# Altium project PCB_ControlBoard.PrjPcb
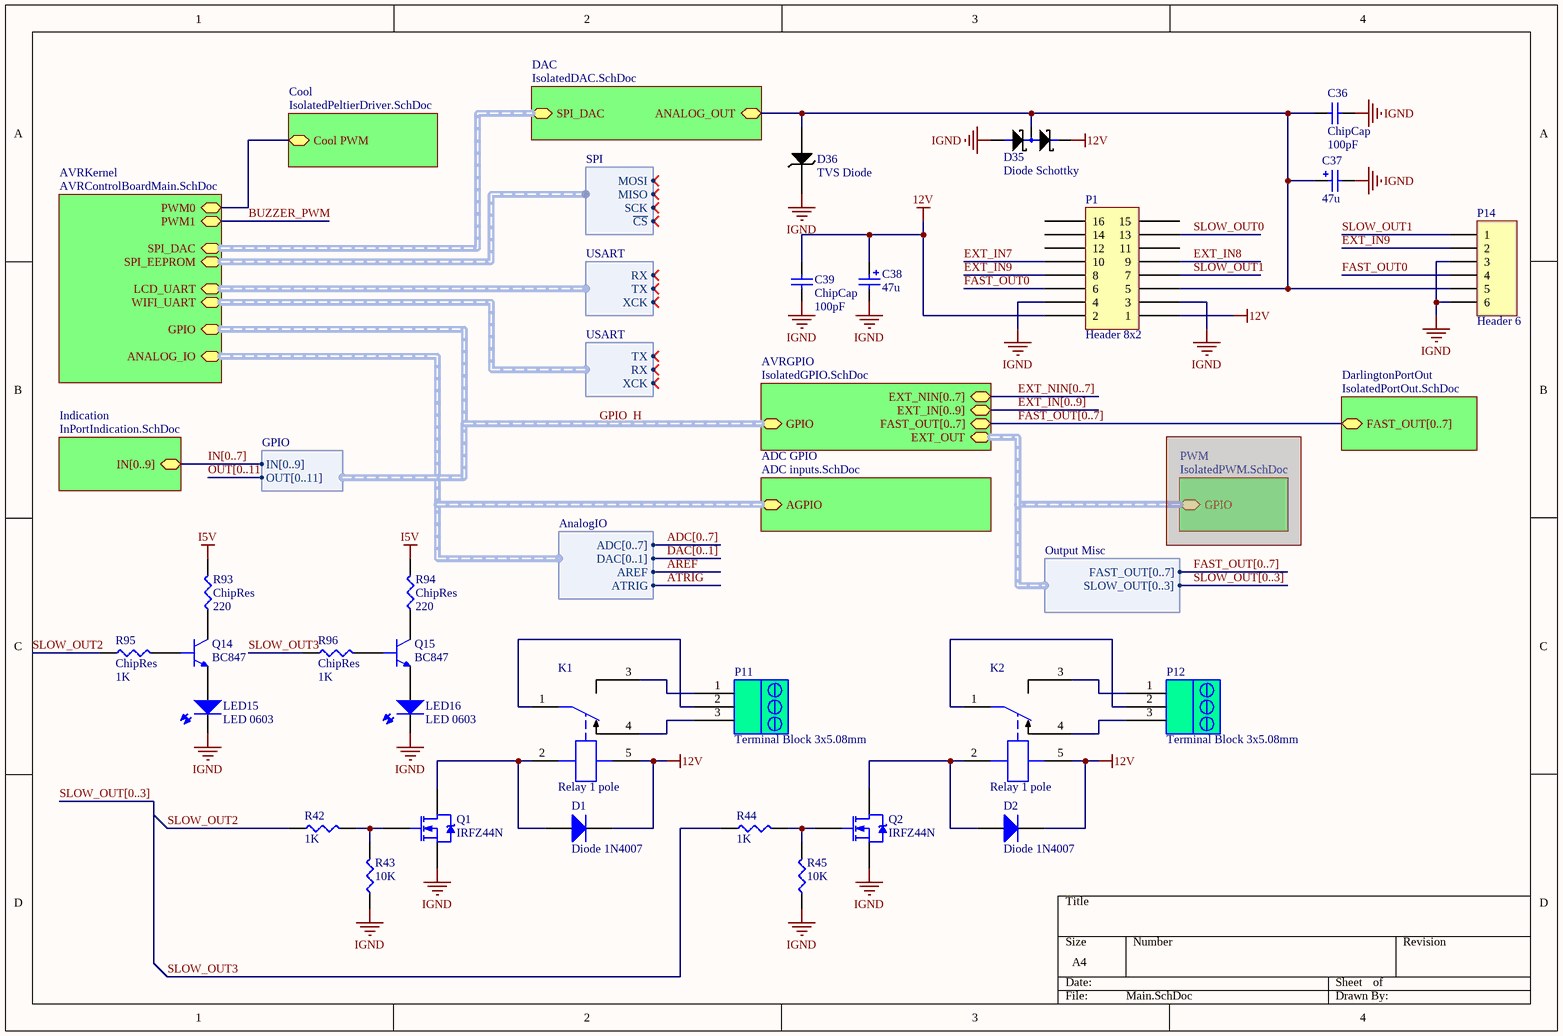
[diagram p0: Main.SchDoc]
9 sheets, 269 parts. Net scope: hierarchical (ports join the sheet entries above them; power ports are global).
Board file: PCBAVRControlBoard.PcbDoc
Sheets:
  Main.SchDoc
    AVRKernel = AVRControlBoardMain.SchDoc
    AVRGPIO = IsolatedGPIO.SchDoc
    DAC = IsolatedDAC.SchDoc
    ADC GPIO = ADC inputs.SchDoc
    DarlingtonPortOut = IsolatedPortOut.SchDoc
    Indication = InPortIndication.SchDoc
    Cool = IsolatedPeltierDriver.SchDoc

## Sheet Main.SchDoc
size A4

### Parts
C36  ChipCap  value 100pF  [CAP0805]
C37  value 47u  [CAPC7343]  (hidden comment: Cap Pol SMD)
C38  value 47u  [CAPC7343]  (hidden comment: Cap Pol SMD)
C39  ChipCap  value 100pF  [CAP0805]
D1  Diode 1N4007  [DO-41]
D2  Diode 1N4007  [DO-41]
D35  Diode Schottky  [SOT23]
D36  TVS Diode  [DO-214AS]
K1  Relay 1 pole  [G5LA]
K2  Relay 1 pole  [G5LA]
LED15  LED 0603  [LED 0603]
LED16  LED 0603  [LED 0603]
P1  Header 8x2  [Header 8x2 HL]
P11  Terminal Block 3x5.08mm  [Socket 3x5.08]
P12  Terminal Block 3x5.08mm  [Socket 3x5.08]
P14  Header 6  [HDR1X6]
Q1  IRFZ44N  [TO-220AB]
Q2  IRFZ44N  [TO-220AB]
Q14  BC847  [SOT23]
Q15  BC847  [SOT23]
R42  value 1K  [RES0805]  (hidden comment: ChipRes)
R43  value 10K  [RES0805]  (hidden comment: ChipRes)
R44  value 1K  [RES0805]  (hidden comment: ChipRes)
R45  value 10K  [RES0805]  (hidden comment: ChipRes)
R93  ChipRes  value 220  [RES0805]
R94  ChipRes  value 220  [RES0805]
R95  ChipRes  value 1K  [RES0805]
R96  ChipRes  value 1K  [RES0805]

### Sub-sheets
ADC GPIO = ADC inputs.SchDoc: AGPIO (harness AnalogIO)
AVRGPIO = IsolatedGPIO.SchDoc: GPIO (harness GPIO), EXT_IN[0..9], EXT_OUT (harness Output Misc), FAST_OUT[0..7], EXT_NIN[0..7]
AVRKernel = AVRControlBoardMain.SchDoc: SPI_DAC (harness SPI), SPI_EEPROM (harness SPI), LCD_UART (harness USART), WIFI_UART (harness USART), ANALOG_IO (harness AnalogIO), GPIO (harness GPIO), PWM0, PWM1
Cool = IsolatedPeltierDriver.SchDoc: Cool PWM
DAC = IsolatedDAC.SchDoc: SPI_DAC (harness SPI), ANALOG_OUT
DarlingtonPortOut = IsolatedPortOut.SchDoc: FAST_OUT[0..7]
Indication = InPortIndication.SchDoc: IN[0..9]
PWM = IsolatedPWM.SchDoc (masked out): GPIO (harness Output Misc)

### Harnesses
USART: TX, RX, XCK
AnalogIO: ADC[0..7], DAC[0..1], AREF, ATRIG
SPI: MOSI, MISO, SCK, ~{CS}
Output Misc: FAST_OUT[0..7], SLOW_OUT[0..3]
GPIO: IN[0..9], OUT[0..11]

### Nets
12V: C38.1 C39.1 D1.2(K) D2.2(K) D35.2 K1.5 K2.5 P1.1 P1.2
I5V: R93.2 R94.2
IGND: C36.2 C37.2 C38.2 C39.2 D35.1 D36.1 LED15.1 LED16.1 P1.3 P1.4 P14.3 P14.6 Q1.3(S) Q2.3(S) R43.1 R45.1
EXT_IN7: P1.10
EXT_IN8: P1.9
EXT_IN9: P1.8 P14.2
FAST_OUT0: P1.6 P14.4
PWM0: sheet AVRKernel/PWM0, sheet Cool/Cool PWM
SLOW_OUT0: P1.13  [project net EXT_OUT0]
SLOW_OUT1: P1.7 P14.1  [project net EXT_OUT1]
SLOW_OUT2: R42.1 R95.1  [project net EXT_OUT2]
SLOW_OUT3: R44.1 R96.1  [project net EXT_OUT3]
NetC36_1: C36.1 C37.1 D35.3 D36.2 P1.5 P14.5 ; sheet DAC/ANALOG_OUT
NetD1_1: D1.1(A) K1.2 Q1.2(D)
NetD2_1: D2.1(A) K2.2 Q2.2(D)
NetK1_1: K1.1 P11.2
NetK1_3: K1.3 P11.1
NetK1_4: K1.4 P11.3
NetK2_1: K2.1 P12.2
NetK2_3: K2.3 P12.1
NetK2_4: K2.4 P12.3
NetLED15_2: LED15.2 Q14.2
NetLED16_2: LED16.2 Q15.2
NetQ1_1: Q1.1(G) R42.2 R43.2
NetQ2_1: Q2.1(G) R44.2 R45.2
NetQ14_1: Q14.1 R95.2
NetQ14_3: Q14.3 R93.1
NetQ15_1: Q15.1 R96.2
NetQ15_3: Q15.3 R94.1

Not connected (* = marked no-connect by the designer): P1 11 12 14 15 16

### Buses and harness runs
bus ADC[0..7]
bus DAC[0..1]
bus EXT_IN[0..9] = sheet AVRGPIO/EXT_IN[0..9]
bus EXT_NIN[0..7] = sheet AVRGPIO/EXT_NIN[0..7]
bus FAST_OUT[0..7]
bus FAST_OUT[0..7] = sheet AVRGPIO/FAST_OUT[0..7] = sheet DarlingtonPortOut/FAST_OUT[0..7]
bus IN[0..7] = sheet Indication/IN[0..9]
bus OUT[0..11]
bus SLOW_OUT[0..3]
harness GPIO_H = sheet AVRGPIO/GPIO = sheet AVRKernel/GPIO
harness sheet ADC GPIO/AGPIO = sheet AVRKernel/ANALOG_IO
harness sheet AVRKernel/SPI_DAC = sheet DAC/SPI_DAC

### Library data of the parts
C36 C39 = ChipCap: Capacitor; Published: 8-Jun-2000; LatestRevisionDate: 17-Jul-2002; LatestRevisionNote: Re-released for DXP Platform.; PackageReference: RAD-0.3; Publisher: Altium Limited
C37 C38 = Cap Pol Chip: Polarized Capacitor (Radial); Supplier 1: Digi-Key; Supplier Part Number 1: 399-4029-1-ND
D1 D2 = Diode 1N4007: 1 Amp General Purpose Rectifier; Published: 8-Jun-2000; LatestRevisionDate: 17-Jul-2002; LatestRevisionNote: Re-released for DXP Platform.; DatasheetVersion: 1998; PackageVersion: Aug-1999; PackageReference: DO-41; Publisher: Altium Limited; PackageDescription: Diode, Axial; Body 5.2 x 2.7 mm (LxDia. max), Lead Dia. 0.86 mm (max); Code_JEDEC: DO-204-AL; ComponentLink1Description: Manufacturer Link; ComponentLink1URL: http://www.fairchildsemi.com/; ComponentLink2Description: Datasheet; ComponentLink2URL: http://www.fairchildsemi.com/ds/1N%2F1N4001.pdf
D35 = Schottky Diode: 2-Diode Schottky
D36 = TVS Diode SMA
K1 K2 = Relay G5LE: Relay G5LE 10A Single Pole
LED15 LED16 = LED0603
P1 = Header 16pins (8x2): Header 16pins (8x2) Hold Latch
P11 P12 = Socket_3x5.08_RA_2Wall: Terminal Block Socket Right Angle 3x5.08mm 2-Wall
P14 = Header 6: Header, 6-Pin; LatestRevisionDate: 17-Jul-2002; LatestRevisionNote: Re-released for DXP Platform.; Publisher: Altium Limited
Q1 Q2 = IRFZ44N: HEXFET Power MOSFET; Note: Pin 2 is electrically connected to pin 4.; Published: 8-Jun-2000; LatestRevisionDate: 17-Jul-2002; LatestRevisionNote: Re-released for DXP Platform.; DatasheetVersion: Aug-1997; PackageVersion: Feb-1997; PackageReference: TO-220AB; Publisher: Altium Limited; PackageDescription: TO, Thru-Hole, Vertical, Heatsink Mounted; 3 In-Line Leads; Pitch 2.54 mm; ComponentLink1Description: Manufacturer Link; ComponentLink1URL: http://www.irf.com/; ComponentLink2Description: Datasheet; ComponentLink2URL: http://www.irf.com/product-info/datasheets/data/irfz44n.pdf
Q14 Q15 = BC847: NPN transistor
R42-R45 R93-R96 = ChipRes: Chip resistor

## Sheet AVRControlBoardMain.SchDoc
size A4
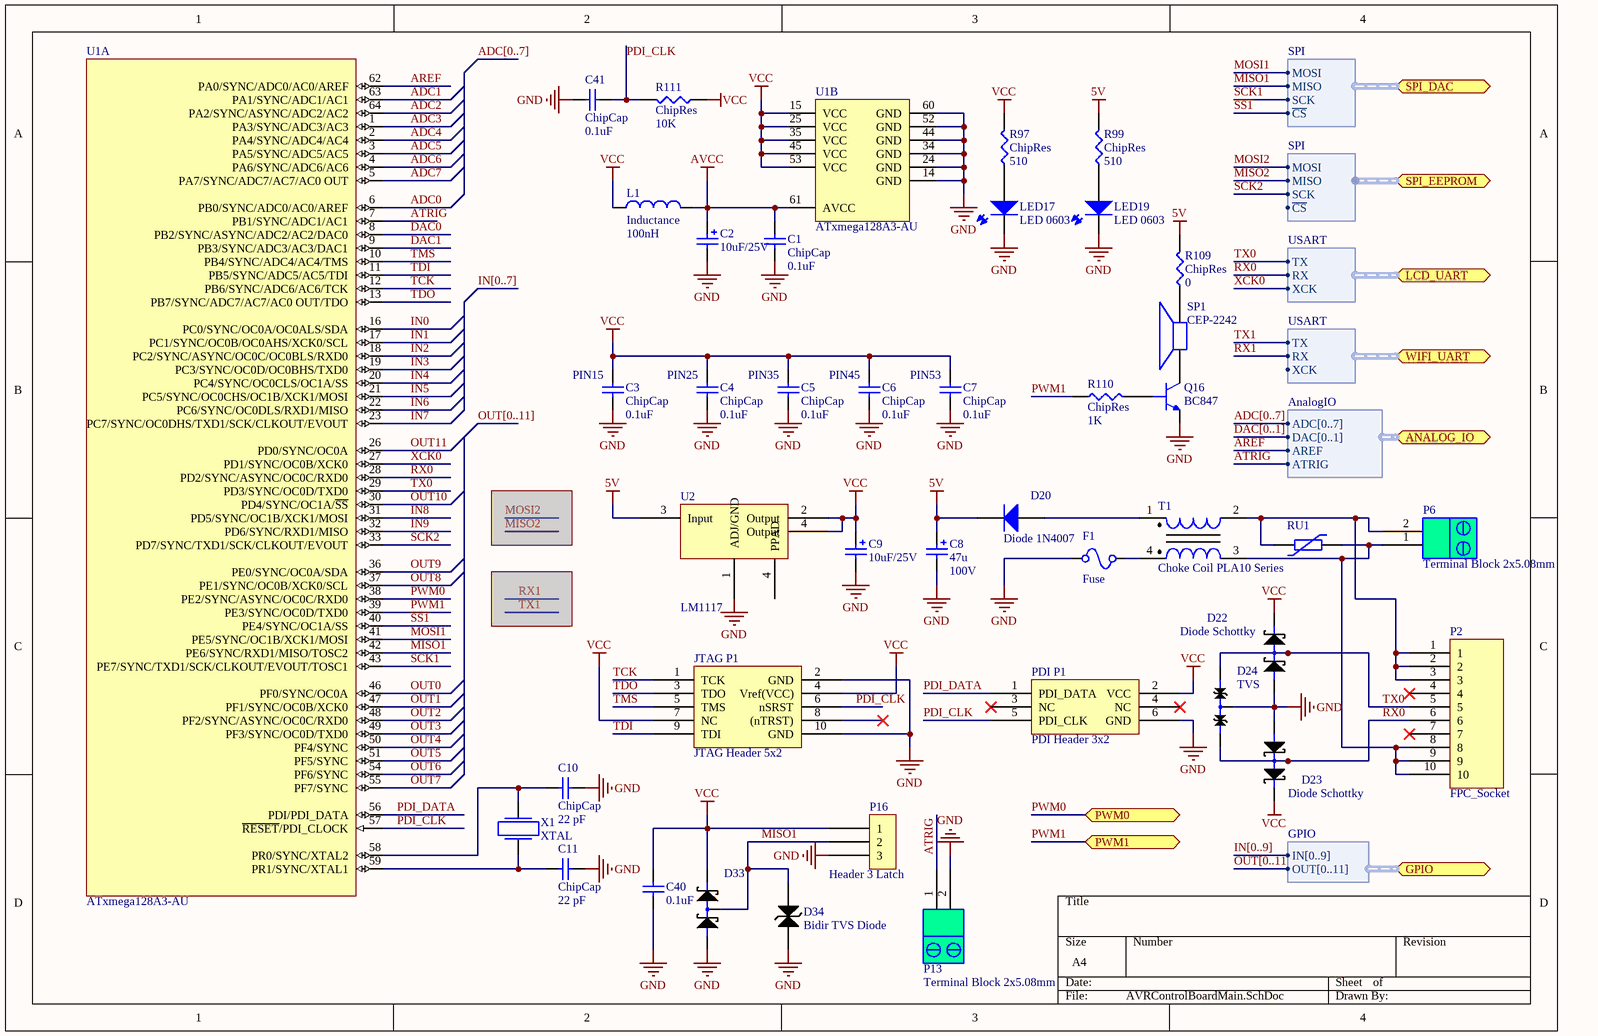
[diagram p1: AVRControlBoardMain.SchDoc]

### Parts
C1  ChipCap  value 0.1uF  [CAP0805]
C2  value 10uF/25V  [CAPC7343]  (hidden comment: Cap Pol SMD)
C3  ChipCap  value 0.1uF  [CAP0805]
C4  ChipCap  value 0.1uF  [CAP0805]
C5  ChipCap  value 0.1uF  [CAP0805]
C6  ChipCap  value 0.1uF  [CAP0805]
C7  ChipCap  value 0.1uF  [CAP0805]
C8  value 47u  Voltage: 100V  [CAPPR5-10x17_1]  (hidden comment: Cap Pol 100/47)
C9  value 10uF/25V  [CAPC7343]  (hidden comment: Cap Pol SMD)
C10  ChipCap  value 22 pF  [CAP0805]
C11  ChipCap  value 22 pF  [CAP0805]
C40  value 0.1uF  [CAP0805]  (hidden comment: ChipCap)
C41  ChipCap  value 0.1uF  [CAP0805]
D20  Diode 1N4007  [DO-41]
D22  Diode Schottky  [SOT23]
D23  Diode Schottky  [SOT23]
D24  TVS  [SOT23]
D33  Diode Schottky  [SOT23]  (value not drawn)
D34  Bidir TVS Diode  [DO-214AS]
F1  Fuse  [PTC1812]
JTAG_P1  JTAG Header 5x2  [Header 5x2]
L1  Inductance  value 100nH  [CM45]
LED17  LED 0603  [PLCC-2]
LED19  LED 0603  [PLCC-2]
P2  FPC_Socket  [Molex FPC/FFC 10pin]
P6  Terminal Block 2x5.08mm  [Socket 2x5.08]
P13  Terminal Block 2x5.08mm  [Socket 2x5.08]
P16  Header 3 Latch  [Header 3 latch]
PDI_P1  PDI Header 3x2  [Header 3x2]
Q16  BC847  [SOT23]
R97  ChipRes  value 510  [RES0805]
R99  ChipRes  value 510  [RES0805]
R109  ChipRes  value 0  [RES0805]
R110  ChipRes  value 1K  [RES0805]
R111  ChipRes  value 10K  [RES0805]
RU1  Varistor S14F25  [S14K25]  (value not drawn)
SP1  CEP-2242  [Buzzer]
T1  Choke Coil PLA10 Series  [PLA10]
U1  ATxmega128A3-AU  [64A_L]  (parts A,B of 2)
U2  LM1117  [SOT223-4M]
X1  XTAL  [BCY-W2/E4.7]

### Ports
ANALOG_IO (harness AnalogIO), GPIO (harness GPIO), LCD_UART (harness USART), PWM0, PWM1, SPI_DAC (harness SPI), SPI_EEPROM (harness SPI), WIFI_UART (harness USART)

### Harnesses
SPI: MOSI, MISO, SCK, ~{CS}
USART: TX, RX, XCK
AnalogIO: ADC[0..7], DAC[0..1], AREF, ATRIG
GPIO: IN[0..9], OUT[0..11]

### Nets
5V: C8.1 D20.2(K) R99.2 R109.2 U2.3(Input)
AVCC: C1.2 C2.1 L1.1 U1.61(AVCC)
GND: C1.1 C2.2 C3.1 C4.1 C5.1 C6.1 C7.1 C8.2 C9.2 C10.1 C11.1 C40.2 C41.1 D22.1 D23.1 D24.3 D33.1 D34.2 F1.1 JTAG_P1.2(GND) JTAG_P1.10(GND) LED17.1 LED19.1 P13.2 P16.3 PDI_P1.6(GND) Q16.2 U1.14(GND) U1.24(GND) U1.34(GND) U1.44(GND) U1.52(GND) U1.60(GND) U2.1(ADJ/GND)
VCC: C3.2 C4.2 C5.2 C6.2 C7.2 C9.1 C40.1 D22.2 D23.2 D33.2 JTAG_P1.4(Vref(VCC)) JTAG_P1.7(NC) L1.2 P16.1 PDI_P1.2(VCC) R97.2 R111.1 U1.15(VCC) U1.25(VCC) U1.35(VCC) U1.45(VCC) U1.53(VCC) U2.2(Output) U2.4(PPAD)
ADC0: U1.6(PB0/SYNC/ADC0/AC0/AREF)
ADC1: U1.63(PA1/SYNC/ADC1/AC1)
ADC2: U1.64(PA2/SYNC/ASYNC/ADC2/AC2)
ADC3: U1.1(PA3/SYNC/ADC3/AC3)
ADC4: U1.2(PA4/SYNC/ADC4/AC4)
ADC5: U1.3(PA5/SYNC/ADC5/AC5)
ADC6: U1.4(PA6/SYNC/ADC6/AC6)
ADC7: U1.5(PA7/SYNC/ADC7/AC7/AC0_OUT)
AREF: U1.62(PA0/SYNC/ADC0/AC0/AREF) ; port ANALOG_IO.AREF
ATRIG: P13.1 U1.7(PB1/SYNC/ADC1/AC1) ; port ANALOG_IO.ATRIG
DAC0: U1.8(PB2/SYNC/ASYNC/ADC2/AC2/DAC0)
DAC1: U1.9(PB3/SYNC/ADC3/AC3/DAC1)
IN0: U1.16(PC0/SYNC/OC0A/OC0ALS/SDA)
IN1: U1.17(PC1/SYNC/OC0B/OC0AHS/XCK0/SCL)
IN2: U1.18(PC2/SYNC/ASYNC/OC0C/OC0BLS/RXD0)
IN3: U1.19(PC3/SYNC/OC0D/OC0BHS/TXD0)
IN4: U1.20(PC4/SYNC/OC0CLS/OC1A/SS)
IN5: U1.21(PC5/SYNC/OC0CHS/OC1B/XCK1/MOSI)
IN6: U1.22(PC6/SYNC/OC0DLS/RXD1/MISO)
IN7: U1.23(PC7/SYNC/OC0DHS/TXD1/SCK/CLKOUT/EVOUT)
IN8: U1.31(PD5/SYNC/OC1B/XCK1/MOSI)
IN9: U1.32(PD6/SYNC/RXD1/MISO)
MISO1: D33.3 D34.1 P16.2 U1.42(PE6/SYNC/RXD1/MISO/TOSC2) ; port SPI_DAC.MISO
MISO2: port SPI_EEPROM.MISO
MOSI1: U1.41(PE5/SYNC/OC1B/XCK1/MOSI) ; port SPI_DAC.MOSI  [project net DAC_MOSI]
MOSI2: port SPI_EEPROM.MOSI
OUT0: U1.46(PF0/SYNC/OC0A)
OUT1: U1.47(PF1/SYNC/OC0B/XCK0)
OUT2: U1.48(PF2/SYNC/ASYNC/OC0C/RXD0)
OUT3: U1.49(PF3/SYNC/OC0D/TXD0)
OUT4: U1.50(PF4/SYNC)
OUT5: U1.51(PF5/SYNC)
OUT6: U1.54(PF6/SYNC)
OUT7: U1.55(PF7/SYNC)
OUT8: U1.37(PE1/SYNC/OC0B/XCK0/SCL)
OUT9: U1.36(PE0/SYNC/OC0A/SDA)
OUT10: U1.30(PD4/SYNC/OC1A/~{SS})
OUT11: U1.26(PD0/SYNC/OC0A)
PDI_CLK: C41.2 JTAG_P1.6(nSRST) PDI_P1.5(PDI_CLK) R111.2 U1.57(~{RESET}/PDI_CLOCK)
PDI_DATA: PDI_P1.1(PDI_DATA) U1.56(PDI/PDI_DATA)
PWM0: U1.38(PE2/SYNC/ASYNC/OC0C/RXD0) ; port PWM0
PWM1: R110.1 U1.39(PE3/SYNC/OC0D/TXD0) ; port PWM1  [project net BUZZER_PWM]
RX0: D23.3 D24.2 P2.6 U1.28(PD2/SYNC/ASYNC/OC0C/RXD0) ; port LCD_UART.RX
RX1: port WIFI_UART.RX
~{SS1}: U1.40(PE4/SYNC/OC1A/SS) ; port SPI_DAC.~{CS}  [project net DAC_CS]
SCK1: U1.43(PE7/SYNC/TXD1/SCK/CLKOUT/EVOUT/TOSC1) ; port SPI_DAC.SCK  [project net DAC_SCK]
SCK2: U1.33(PD7/SYNC/TXD1/SCK/CLKOUT/EVOUT) ; port SPI_EEPROM.SCK
TCK: JTAG_P1.1(TCK) U1.12(PB6/SYNC/ADC6/AC6/TCK)
TDI: JTAG_P1.9(TDI) U1.11(PB5/SYNC/ADC5/AC5/TDI)
TDO: JTAG_P1.3(TDO) U1.13(PB7/SYNC/ADC7/AC7/AC0_OUT/TDO)
TMS: JTAG_P1.5(TMS) U1.10(PB4/SYNC/ADC4/AC4/TMS)
TX0: D22.3 D24.1 P2.5 U1.29(PD3/SYNC/OC0D/TXD0) ; port LCD_UART.TX
TX1: port WIFI_UART.TX
XCK0: U1.27(PD1/SYNC/OC0B/XCK0) ; port LCD_UART.XCK
NetC10_2: C10.2 U1.58(PR0/SYNC/XTAL2) X1.2
NetC11_2: C11.2 U1.59(PR1/SYNC/XTAL1) X1.1
NetD20_1: D20.1(A) T1.1
NetF1_2: F1.2 T1.4
NetLED17_2: LED17.2 R97.1
NetLED19_2: LED19.2 R99.1
NetP2_1: P2.1 P2.2 P2.3 P6.2 RU1.1 T1.2
NetP2_8: P2.8 P2.9 P2.10 P6.1 RU1.2 T1.3
NetQ16_1: Q16.1 R110.2
NetQ16_3: Q16.3 SP1.1
NetR109_1: R109.1 SP1.2

Not connected (* = marked no-connect by the designer): JTAG_P1 8((nTRST))*; P2 4* 7*; PDI_P1 3(NC)* 4(NC)*

### Buses and harness runs
bus ADC[0..7]
bus DAC[0..1]
bus IN[0..7]
bus IN[0..9]
bus OUT[0..11]

### Notes on the sheet
- (near C3) PIN15
- (near C4) PIN25
- (near C5) PIN35
- (near C6) PIN45
- (near C7) PIN53

### Library data of the parts
C1 C3-C7 C10 C11 C40 C41 = ChipCap: Capacitor; Published: 8-Jun-2000; LatestRevisionDate: 17-Jul-2002; LatestRevisionNote: Re-released for DXP Platform.; PackageReference: RAD-0.3; Publisher: Altium Limited
C2 C9 = Cap Pol Chip: Polarized Capacitor (Radial); Supplier 1: Digi-Key; Supplier Part Number 1: 399-4029-1-ND
C8 = Cap Pol 100/47: Polarized Capacitor (Radial); Supplier 1: Digi-Key; Supplier Part Number 1: P1284-ND
D20 = Diode 1N4007: 1 Amp General Purpose Rectifier; Published: 8-Jun-2000; LatestRevisionDate: 17-Jul-2002; LatestRevisionNote: Re-released for DXP Platform.; DatasheetVersion: 1998; PackageVersion: Aug-1999; PackageReference: DO-41; Publisher: Altium Limited; PackageDescription: Diode, Axial; Body 5.2 x 2.7 mm (LxDia. max), Lead Dia. 0.86 mm (max); Code_JEDEC: DO-204-AL; ComponentLink1Description: Manufacturer Link; ComponentLink1URL: http://www.fairchildsemi.com/; ComponentLink2Description: Datasheet; ComponentLink2URL: http://www.fairchildsemi.com/ds/1N%2F1N4001.pdf
D22 D23 D33 = Schottky Diode: 2-Diode Schottky
D24 = TVS Diode: Dual bidirectional voltage supresor
D34 = TVS Bidir Diode SMA
F1 = Fuse PTC1812: Fuse PTC 1812 Thermoresistor
JTAG_P1 = JTAG Header 5x2: JTAG Interface connctor
L1 = ChipInductance
LED17 LED19 = LED0603
P6 P13 = Socket_2x5.08_RA_2Wall: Terminal Block Socket Right Angle 2x5.08mm 2 Wall
P16 = Header 3 latch: Header 3 with latch
PDI_P1 = PDI Header 3x2: PDI Interface connector
Q16 = BC847: NPN transistor
R97 R99 R109-R111 = ChipRes: Chip resistor
RU1 = Varistor S14K25: varistor
SP1 = Buzzer CEP-2242: Buzzer
T1 = Choke Coil: Common Mode Rejection Choke Coil LA10 Series
U1 = ATxmega128A3-AU: 8/16-bit AVR XMEGA A3 Microcontroller, 1.6-3.6V, 128KB + 8KB Flash, 2KB EEPROM, 8KB SRAM, 64-pin TQFP, Industrial Grade (-40°C to 85°C), Pb-Free; Published: 1-Apr-2010; DatasheetVersion: revQ, Feb-2010; PackageVersion: revB, Oct-2001; PackageReference: 64A; Publisher: Altium Limited; PackageDescription: 64-Pin Plastic Thin Profile Quad Flat Pack, 14 x 14 x 1.0 mm Body, 0.8 mm Pitch (TQFP); Supplier 1: Digi-Key; Supplier Part Number 1: ATXMEGA128A3-AU-ND; Supplier 2: Farnell; Supplier Part Number 2: 1748550; Supplier 3: Mouser; Supplier Part Number 3: 556-ATXMEGA128A3-AU; Code_JEDEC: MS-026-AEB; ComponentLink1Description: Manufacturer Link; ComponentLink1URL: http://www.atmel.com/products/avr/default.asp?; ComponentLink2Description: ATxmega64A3/128A3/192A3/256A3 Datasheet; ComponentLink2URL: http://www.atmel.com/dyn/resources/prod_documents/doc8068.pdf; ComponentLink3Description: Atmel.com Home; ComponentLink3URL: http://www.atmel.com
U2 = LM1117: Power Mgt Voltage Regulator
X1 = Crystall oscillator: Quartz crystall oscillator

## Sheet IsolatedGPIO.SchDoc
size A4
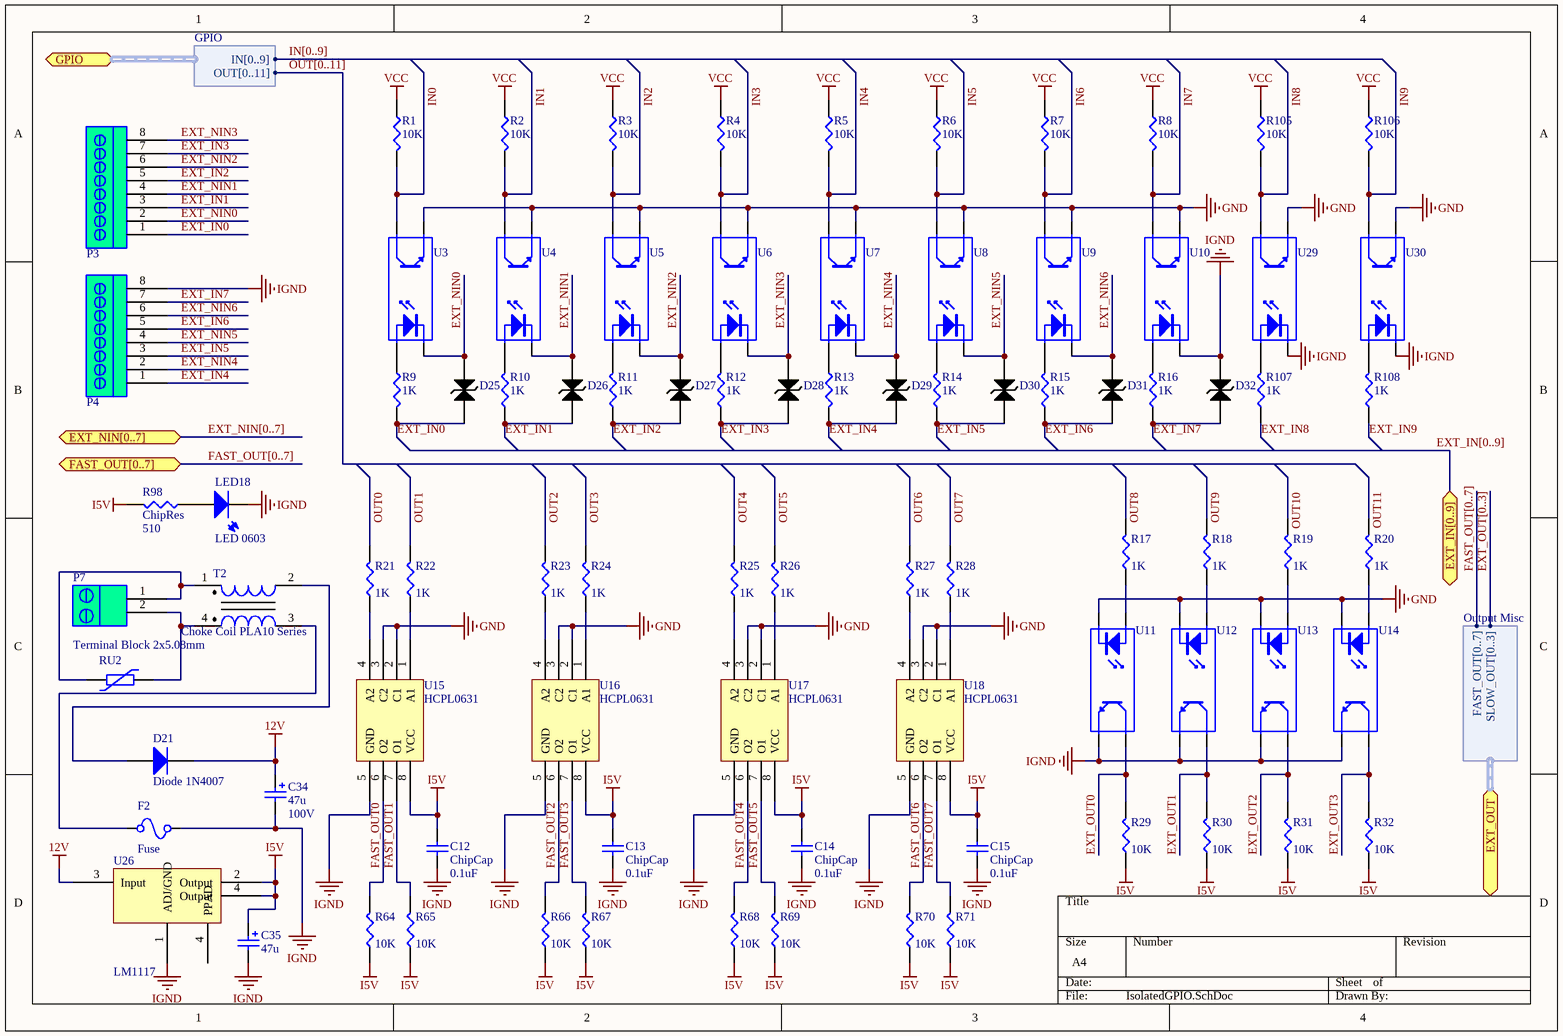
[diagram p2: IsolatedGPIO.SchDoc]

### Parts
C12  ChipCap  value 0.1uF  [CAP0805]
C13  ChipCap  value 0.1uF  [CAP0805]
C14  ChipCap  value 0.1uF  [CAP0805]
C15  ChipCap  value 0.1uF  [CAP0805]
C34  value 47u  Voltage: 100V  [CAPPR5-10x17_1]  (hidden comment: Cap Pol 100/47)
C35  value 47u  [CAPC7343]  (hidden comment: Cap Pol SMD)
D21  Diode 1N4007  [DO-41]
D25  Bidir TVS Diode  [DO-214AS]  (value not drawn)
D26  Bidir TVS Diode  [DO-214AS]  (value not drawn)
D27  Bidir TVS Diode  [DO-214AS]  (value not drawn)
D28  Bidir TVS Diode  [DO-214AS]  (value not drawn)
D29  Bidir TVS Diode  [DO-214AS]  (value not drawn)
D30  Bidir TVS Diode  [DO-214AS]  (value not drawn)
D31  Bidir TVS Diode  [DO-214AS]  (value not drawn)
D32  Bidir TVS Diode  [DO-214AS]  (value not drawn)
F2  Fuse  [PTC1812]
LED18  LED 0603  [PLCC-2]
P3  Terminal Block 8x5.08mm  [SOCKET 8x5.08]  (value not drawn)
P4  Terminal Block 8x5.08mm  [SOCKET 8x5.08]  (value not drawn)
P7  Terminal Block 2x5.08mm  [Socket 2x5.08]
R1  value 10K  [RES0805]  (hidden comment: ChipRes)
R2  value 10K  [RES0805]  (hidden comment: ChipRes)
R3  value 10K  [RES0805]  (hidden comment: ChipRes)
R4  value 10K  [RES0805]  (hidden comment: ChipRes)
R5  value 10K  [RES0805]  (hidden comment: ChipRes)
R6  value 10K  [RES0805]  (hidden comment: ChipRes)
R7  value 10K  [RES0805]  (hidden comment: ChipRes)
R8  value 10K  [RES0805]  (hidden comment: ChipRes)
R9  value 1K  [RES0805]  (hidden comment: ChipRes)
R10  value 1K  [RES0805]  (hidden comment: ChipRes)
R11  value 1K  [RES0805]  (hidden comment: ChipRes)
R12  value 1K  [RES0805]  (hidden comment: ChipRes)
R13  value 1K  [RES0805]  (hidden comment: ChipRes)
R14  value 1K  [RES0805]  (hidden comment: ChipRes)
R15  value 1K  [RES0805]  (hidden comment: ChipRes)
R16  value 1K  [RES0805]  (hidden comment: ChipRes)
R17  value 1K  [RES0805]  (hidden comment: ChipRes)
R18  value 1K  [RES0805]  (hidden comment: ChipRes)
R19  value 1K  [RES0805]  (hidden comment: ChipRes)
R20  value 1K  [RES0805]  (hidden comment: ChipRes)
R21  value 1K  [RES0805]  (hidden comment: ChipRes)
R22  value 1K  [RES0805]  (hidden comment: ChipRes)
R23  value 1K  [RES0805]  (hidden comment: ChipRes)
R24  value 1K  [RES0805]  (hidden comment: ChipRes)
R25  value 1K  [RES0805]  (hidden comment: ChipRes)
R26  value 1K  [RES0805]  (hidden comment: ChipRes)
R27  value 1K  [RES0805]  (hidden comment: ChipRes)
R28  value 1K  [RES0805]  (hidden comment: ChipRes)
R29  value 10K  [RES0805]  (hidden comment: ChipRes)
R30  value 10K  [RES0805]  (hidden comment: ChipRes)
R31  value 10K  [RES0805]  (hidden comment: ChipRes)
R32  value 10K  [RES0805]  (hidden comment: ChipRes)
R64  value 10K  [RES0805]  (hidden comment: ChipRes)
R65  value 10K  [RES0805]  (hidden comment: ChipRes)
R66  value 10K  [RES0805]  (hidden comment: ChipRes)
R67  value 10K  [RES0805]  (hidden comment: ChipRes)
R68  value 10K  [RES0805]  (hidden comment: ChipRes)
R69  value 10K  [RES0805]  (hidden comment: ChipRes)
R70  value 10K  [RES0805]  (hidden comment: ChipRes)
R71  value 10K  [RES0805]  (hidden comment: ChipRes)
R98  ChipRes  value 510  [RES0805]
R105  value 10K  [RES0805]  (hidden comment: ChipRes)
R106  value 10K  [RES0805]  (hidden comment: ChipRes)
R107  value 1K  [RES0805]  (hidden comment: ChipRes)
R108  value 1K  [RES0805]  (hidden comment: ChipRes)
RU2  Varistor S14F25  [S14K25]  (value not drawn)
T2  Choke Coil PLA10 Series  [PLA10]
U3  Optoisolator1  [DIP-4]  (value not drawn)
U4  Optoisolator1  [DIP-4]  (value not drawn)
U5  Optoisolator1  [DIP-4]  (value not drawn)
U6  Optoisolator1  [DIP-4]  (value not drawn)
U7  Optoisolator1  [DIP-4]  (value not drawn)
U8  Optoisolator1  [DIP-4]  (value not drawn)
U9  Optoisolator1  [DIP-4]  (value not drawn)
U10  Optoisolator1  [DIP-4]  (value not drawn)
U11  Optoisolator1  [DIP-4]  (value not drawn)
U12  Optoisolator1  [DIP-4]  (value not drawn)
U13  Optoisolator1  [DIP-4]  (value not drawn)
U14  Optoisolator1  [DIP-4]  (value not drawn)
U15  HCPL0631  [SOIC8]
U16  HCPL0631  [SOIC8]
U17  HCPL0631  [SOIC8]
U18  HCPL0631  [SOIC8]
U26  LM1117  [SOT223-4M]
U29  Optoisolator1  [DIP-4]  (value not drawn)
U30  Optoisolator1  [DIP-4]  (value not drawn)

### Ports
EXT_IN[0..9], EXT_NIN[0..7], EXT_OUT (harness Output Misc), FAST_OUT[0..7], GPIO (harness GPIO)

### Harnesses
GPIO: IN[0..9], OUT[0..11]
Output Misc: FAST_OUT[0..7], SLOW_OUT[0..3]

### Nets
12V: C34.1 D21.2(K) U26.3(Input)
GND: U3.3(E) U4.3(E) U5.3(E) U6.3(E) U7.3(E) U8.3(E) U9.3(E) U10.3(E) U11.2(K) U12.2(K) U13.2(K) U14.2(K) U15.2(C1) U15.3(C2) U16.2(C1) U16.3(C2) U17.2(C1) U17.3(C2) U18.2(C1) U18.3(C2) U29.3(E) U30.3(E)
I5V: C12.2 C13.2 C14.2 C15.2 C35.1 R29.1 R30.1 R31.1 R32.1 R64.1 R65.1 R66.1 R67.1 R68.1 R69.1 R70.1 R71.1 R98.2 U15.8(VCC) U16.8(VCC) U17.8(VCC) U18.8(VCC) U26.2(Output) U26.4(PPAD)
IGND: C12.1 C13.1 C14.1 C15.1 C34.2 C35.2 D32.2 F2.2 LED18.1 P4.8 U10.2(K) U11.3(E) U12.3(E) U13.3(E) U14.3(E) U15.5(GND) U16.5(GND) U17.5(GND) U18.5(GND) U26.1(ADJ/GND) U29.2(K) U30.2(K)
VCC: R1.1 R2.1 R3.1 R4.1 R5.1 R6.1 R7.1 R8.1 R105.1 R106.1
EXT_IN0: D25.1 P3.1 R9.2
EXT_IN1: D26.1 P3.3 R10.1
EXT_IN2: D27.1 P3.5 R11.1
EXT_IN3: D28.1 P3.7 R12.1
EXT_IN4: D29.1 P4.1 R13.2
EXT_IN5: D30.1 P4.3 R14.1
EXT_IN6: D31.1 P4.5 R15.1
EXT_IN7: D32.1 P4.7 R16.1
EXT_IN8: R107.1
EXT_IN9: R108.1
EXT_NIN0: D25.2 P3.2 U3.2(K)
EXT_NIN1: D26.2 P3.4 U4.2(K)
EXT_NIN2: D27.2 P3.6 U5.2(K)
EXT_NIN3: D28.2 P3.8 U6.2(K)
EXT_NIN4: D29.2 P4.2 U7.2(K)
EXT_NIN5: D30.2 P4.4 U8.2(K)
EXT_NIN6: D31.2 P4.6 U9.2(K)
EXT_OUT0: R29.2 U11.4(C)
EXT_OUT1: R30.2 U12.4(C)
EXT_OUT2: R31.2 U13.4(C)
EXT_OUT3: R32.2 U14.4(C)
FAST_OUT0: R64.2 U15.6(O2)
FAST_OUT1: R65.2 U15.7(O1)
FAST_OUT2: R66.2 U16.6(O2)
FAST_OUT3: R67.2 U16.7(O1)
FAST_OUT4: R68.2 U17.6(O2)
FAST_OUT5: R69.2 U17.7(O1)
FAST_OUT6: R70.2 U18.6(O2)
FAST_OUT7: R71.2 U18.7(O1)
IN0: R1.2 U3.4(C)
IN1: R2.2 U4.4(C)
IN2: R3.2 U5.4(C)
IN3: R4.2 U6.4(C)
IN4: R5.2 U7.4(C)
IN5: R6.2 U8.4(C)
IN6: R7.2 U9.4(C)
IN7: R8.2 U10.4(C)
IN8: R105.2 U29.4(C)
IN9: R106.2 U30.4(C)
OUT0: R21.2
OUT1: R22.2
OUT2: R23.2
OUT3: R24.2
OUT4: R25.2
OUT5: R26.2
OUT6: R27.2
OUT7: R28.2
OUT8: R17.2
OUT9: R18.2
OUT10: R19.2
OUT11: R20.2
NetD21_1: D21.1(A) T2.2
NetF2_1: F2.1 T2.3
NetLED18_2: LED18.2 R98.1
NetP7_1: P7.1 RU2.1 T2.1
NetP7_2: P7.2 RU2.2 T2.4
NetR9_1: R9.1 U3.1(A)
NetR10_2: R10.2 U4.1(A)
NetR11_2: R11.2 U5.1(A)
NetR12_2: R12.2 U6.1(A)
NetR13_1: R13.1 U7.1(A)
NetR14_2: R14.2 U8.1(A)
NetR15_2: R15.2 U9.1(A)
NetR16_2: R16.2 U10.1(A)
NetR17_1: R17.1 U11.1(A)
NetR18_1: R18.1 U12.1(A)
NetR19_1: R19.1 U13.1(A)
NetR20_1: R20.1 U14.1(A)
NetR21_1: R21.1 U15.4(A2)
NetR22_1: R22.1 U15.1(A1)
NetR23_1: R23.1 U16.4(A2)
NetR24_1: R24.1 U16.1(A1)
NetR25_1: R25.1 U17.4(A2)
NetR26_1: R26.1 U17.1(A1)
NetR27_1: R27.1 U18.4(A2)
NetR28_1: R28.1 U18.1(A1)
NetR107_2: R107.2 U29.1(A)
NetR108_2: R108.2 U30.1(A)

### Buses and harness runs
bus EXT_IN[0..9] = port EXT_IN[0..9]
bus EXT_NIN[0..7] = port EXT_NIN[0..7]
bus EXT_OUT[0..3]
bus FAST_OUT[0..7]
bus FAST_OUT[0..7] = port FAST_OUT[0..7]
bus IN[0..9]
bus OUT[0..11]

### Library data of the parts
C12-C15 = ChipCap: Capacitor; Published: 8-Jun-2000; LatestRevisionDate: 17-Jul-2002; LatestRevisionNote: Re-released for DXP Platform.; PackageReference: RAD-0.3; Publisher: Altium Limited
C34 = Cap Pol 100/47: Polarized Capacitor (Radial); Supplier 1: Digi-Key; Supplier Part Number 1: P1284-ND
C35 = Cap Pol Chip: Polarized Capacitor (Radial); Supplier 1: Digi-Key; Supplier Part Number 1: 399-4029-1-ND
D21 = Diode 1N4007: 1 Amp General Purpose Rectifier; Published: 8-Jun-2000; LatestRevisionDate: 17-Jul-2002; LatestRevisionNote: Re-released for DXP Platform.; DatasheetVersion: 1998; PackageVersion: Aug-1999; PackageReference: DO-41; Publisher: Altium Limited; PackageDescription: Diode, Axial; Body 5.2 x 2.7 mm (LxDia. max), Lead Dia. 0.86 mm (max); Code_JEDEC: DO-204-AL; ComponentLink1Description: Manufacturer Link; ComponentLink1URL: http://www.fairchildsemi.com/; ComponentLink2Description: Datasheet; ComponentLink2URL: http://www.fairchildsemi.com/ds/1N%2F1N4001.pdf
D25-D32 = TVS Bidir Diode SMA
F2 = Fuse PTC1812: Fuse PTC 1812 Thermoresistor
LED18 = LED0603
P3 P4 = Socket_8x5.08_RA_2Wall: Terminal Block Socket Right Angle 8x5.08mm 2-Wall
P7 = Socket_2x5.08_RA_2Wall: as P6 on sheet AVRControlBoardMain
R1-R32 R64-R71 R98 R105-R108 = ChipRes: Chip resistor
RU2 = Varistor S14K25: varistor
T2 = Choke Coil: as T1 on sheet AVRControlBoardMain
U3-U14 U29 U30 = Optoisolator1: 4-Pin Phototransistor Optocoupler; Published: 24-Mar-1999; LatestRevisionDate: 04-Mar-2005; LatestRevisionNote: Sch pins 3 & 4 Swapped.; DatasheetVersion: Nov-2003; PackageReference: DIP-4; Publisher: Altium Limited
U15-U18 = HCPL0631: 2-channel opto-coupler
U26 = LM1117: Power Mgt Voltage Regulator

## Sheet IsolatedDAC.SchDoc
size A4
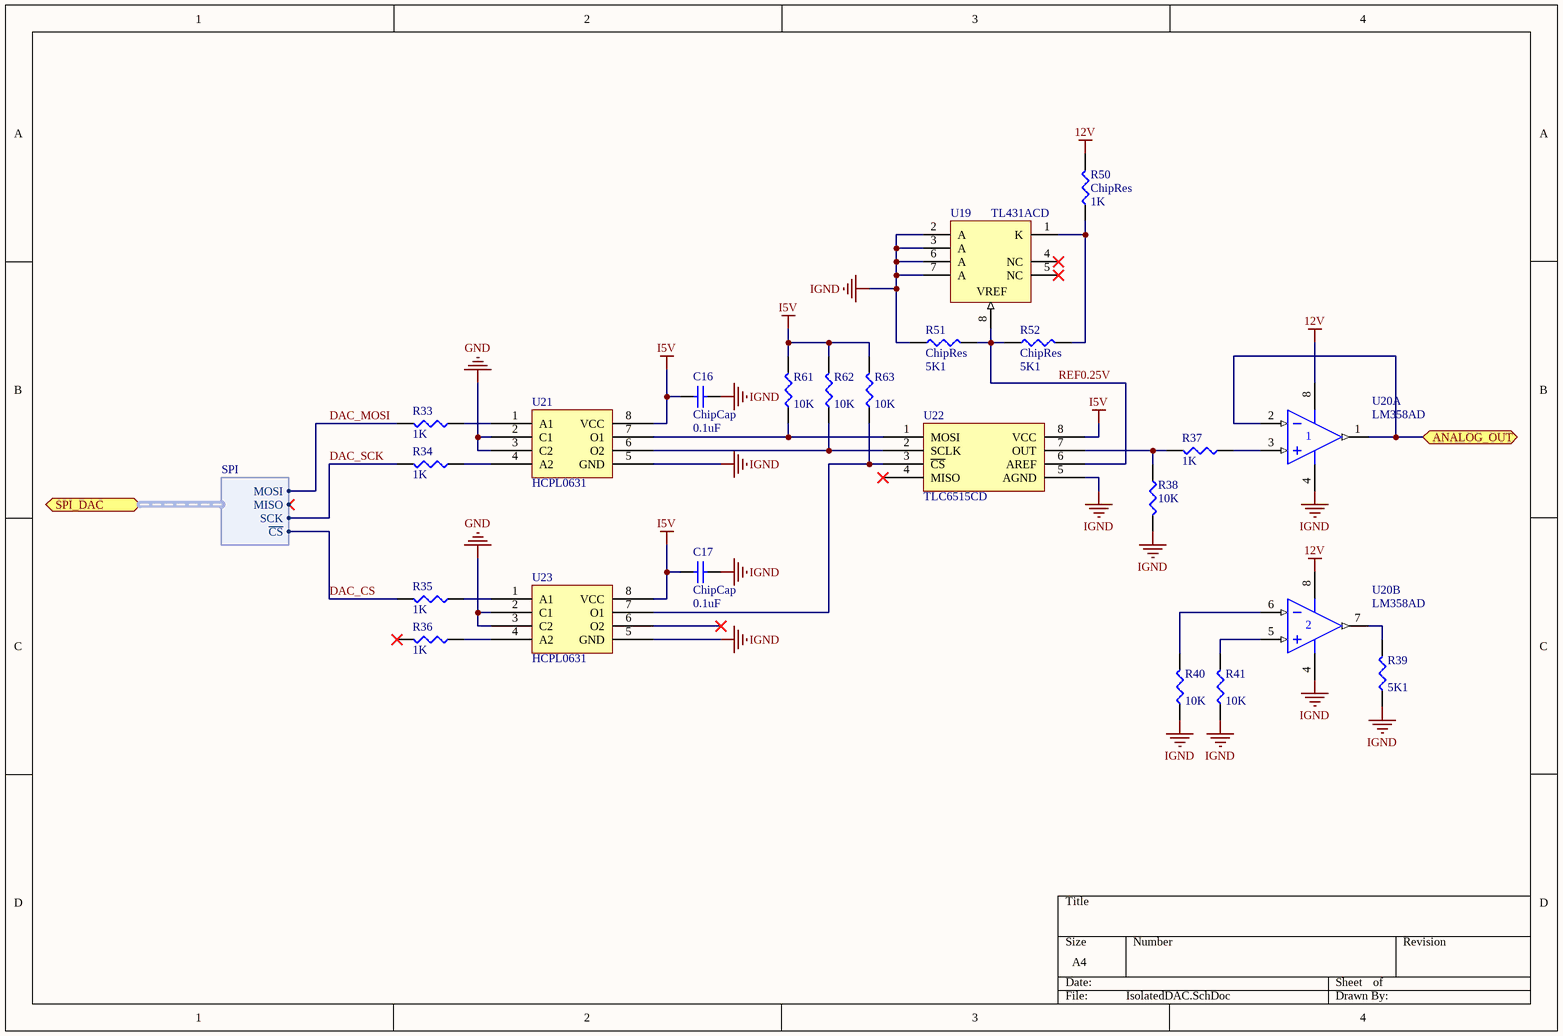
[diagram p3: IsolatedDAC.SchDoc]

### Parts
C16  ChipCap  value 0.1uF  [CAP0805]
C17  ChipCap  value 0.1uF  [CAP0805]
R33  value 1K  [RES0805]  (hidden comment: ChipRes)
R34  value 1K  [RES0805]  (hidden comment: ChipRes)
R35  value 1K  [RES0805]  (hidden comment: ChipRes)
R36  value 1K  [RES0805]  (hidden comment: ChipRes)
R37  value 1K  [RES0805]  (hidden comment: ChipRes)
R38  value 10K  [RES0805]  (hidden comment: ChipRes)
R39  value 5K1  [RES0805]  (hidden comment: ChipRes)
R40  value 10K  [RES0805]  (hidden comment: ChipRes)
R41  value 10K  [RES0805]  (hidden comment: ChipRes)
R50  ChipRes  value 1K  [RES0805]
R51  ChipRes  value 5K1  [RES0805]
R52  ChipRes  value 5K1  [RES0805]
R61  value 10K  [RES0805]  (hidden comment: ChipRes)
R62  value 10K  [RES0805]  (hidden comment: ChipRes)
R63  value 10K  [RES0805]  (hidden comment: ChipRes)
U19  TL431ACD  [D008_N]
U20  LM358AD  [D008_L]  (parts A,B of 2)
U21  HCPL0631  [SOIC8]
U22  TLC6515CD  [SOIC8]
U23  HCPL0631  [SOIC8]

### Ports
ANALOG_OUT, SPI_DAC (harness SPI)

### Harnesses
SPI: MOSI, MISO, SCK, ~{CS}

### Nets
12V: R50.2 U20.8(V+)
GND: U21.2(C1) U21.3(C2) U23.2(C1) U23.3(C2)
I5V: C16.2 C17.2 R61.2 R62.2 R63.2 U21.8(VCC) U22.8(VCC) U23.8(VCC)
IGND: C16.1 C17.1 R38.2 R39.1 R40.1 R41.1 R51.1 U19.2(A) U19.3(A) U19.6(A) U19.7(A) U20.4(V-) U21.5(GND) U22.5(AGND) U23.5(GND)
DAC_CS: R35.2 ; port SPI_DAC.~{CS}
DAC_MOSI: R33.2 ; port SPI_DAC.MOSI
DAC_SCK: R34.2 ; port SPI_DAC.SCK
REF0.25V: R51.2 R52.1 U19.8(VREF) U22.6(AREF)
NetC36_1: U20.1(OUT) U20.2(IN-) ; port ANALOG_OUT
NetR33_1: R33.1 U21.1(A1)
NetR34_1: R34.1 U21.4(A2)
NetR35_1: R35.1 U23.1(A1)
NetR36_1: R36.1 U23.4(A2)
NetR37_1: R37.1 U20.3(IN+)
NetR37_2: R37.2 R38.1 U22.7(OUT)
NetR39_2: R39.2 U20.7(OUT)
NetR40_2: R40.2 U20.6(IN-)
NetR41_2: R41.2 U20.5(IN+)
NetR50_1: R50.1 R52.2 U19.1(K)
NetR61_1: R61.1 U21.7(O1) U22.1(MOSI)
NetR62_1: R62.1 U21.6(O2) U22.2(SCLK)
NetR63_1: R63.1 U22.3(~{CS}) U23.7(O1)

Not connected (* = marked no-connect by the designer): R36 2*; U19 4(NC)* 5(NC)*; U22 4(MISO)*; U23 6(O2)*

### Library data of the parts
C16 C17 = ChipCap: Capacitor; Published: 8-Jun-2000; LatestRevisionDate: 17-Jul-2002; LatestRevisionNote: Re-released for DXP Platform.; PackageReference: RAD-0.3; Publisher: Altium Limited
R33-R41 R50-R52 R61-R63 = ChipRes: Chip resistor
U19 = TL431ACD: Adjustable Precision Shunt Regulator; Published: 15-Apr-2002; LatestRevisionDate: 13-Apr-2006; LatestRevisionNote: IPC-7351 Footprint Added.; DatasheetVersion: Oct-2000; PackageVersion: Jan-1998; PackageReference: D008; Publisher: Altium Limited; PackageDescription: 8-Pin Small Outline Integrated Circuit 1.27 mm Pitch; Code_IPC: SOIC127P600-8; ComponentLink1Description: Manufacturer Link; ComponentLink1URL: http://www.ti.com/; ComponentLink2Description: Datasheet; ComponentLink2URL: http://www-s.ti.com/sc/ds/tl431a.pdf
U20 = LM358AD: Dual Operational Amplifier; Published: 15-Apr-2002; LatestRevisionDate: 13-Apr-2006; LatestRevisionNote: IPC-7351 Footprint Added.; DatasheetVersion: Aug-1988; PackageVersion: Jan-1998; PackageReference: D008; Publisher: Altium Limited; PackageDescription: 8-Pin Small Outline Integrated Circuit 1.27 mm Pitch; Code_IPC: SOIC127P600-8; ComponentLink1Description: Manufacturer Link; ComponentLink1URL: http://www.ti.com/; ComponentLink2Description: Datasheet; ComponentLink2URL: http://www-s.ti.com/sc/ds/lm358.pdf
U21 U23 = HCPL0631: 2-channel opto-coupler
U22 = TLC6515: 10-bit analog to digiyal converter; Manufacturer: Texas Instruments

## Sheet ADC inputs.SchDoc
size A4
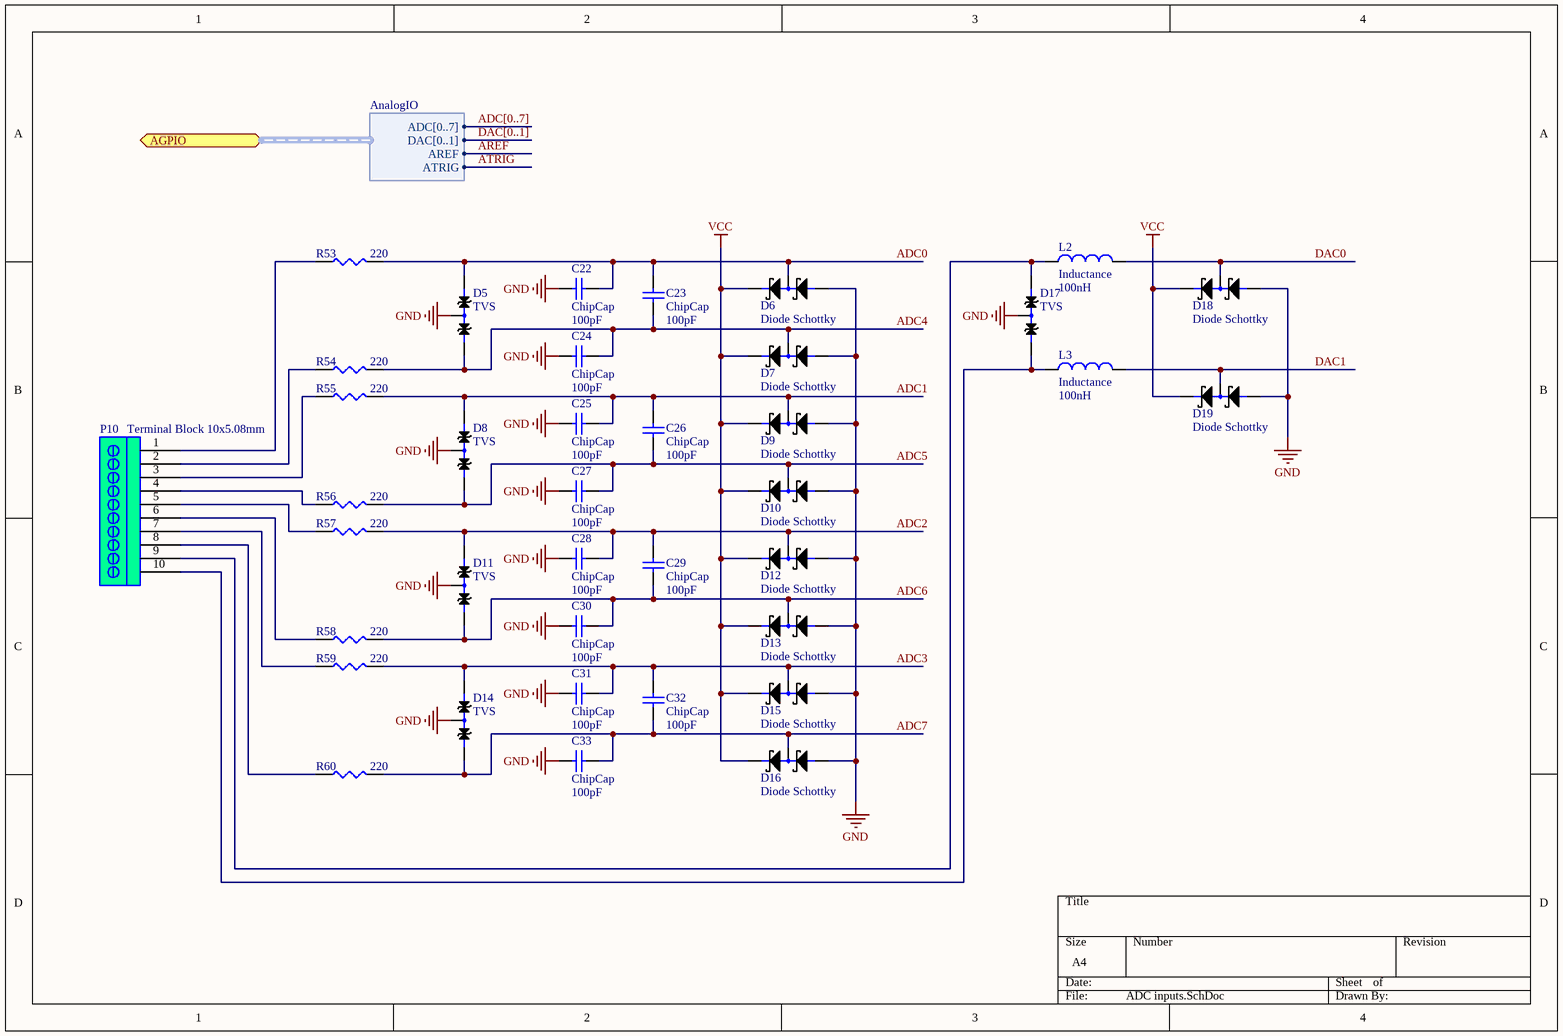
[diagram p4: ADC inputs.SchDoc]

### Parts
C22  ChipCap  value 100pF  [CAP0805]
C23  ChipCap  value 100pF  [CAP0805]
C24  ChipCap  value 100pF  [CAP0805]
C25  ChipCap  value 100pF  [CAP0805]
C26  ChipCap  value 100pF  [CAP0805]
C27  ChipCap  value 100pF  [CAP0805]
C28  ChipCap  value 100pF  [CAP0805]
C29  ChipCap  value 100pF  [CAP0805]
C30  ChipCap  value 100pF  [CAP0805]
C31  ChipCap  value 100pF  [CAP0805]
C32  ChipCap  value 100pF  [CAP0805]
C33  ChipCap  value 100pF  [CAP0805]
D5  TVS  [SOT23]
D6  Diode Schottky  [SOT23]
D7  Diode Schottky  [SOT23]
D8  TVS  [SOT23]
D9  Diode Schottky  [SOT23]
D10  Diode Schottky  [SOT23]
D11  TVS  [SOT23]
D12  Diode Schottky  [SOT23]
D13  Diode Schottky  [SOT23]
D14  TVS  [SOT23]
D15  Diode Schottky  [SOT23]
D16  Diode Schottky  [SOT23]
D17  TVS  [SOT23]
D18  Diode Schottky  [SOT23]
D19  Diode Schottky  [SOT23]
L2  Inductance  value 100nH  [CM45]
L3  Inductance  value 100nH  [CM45]
P10  Terminal Block 10x5.08mm  [Socket 10x5.08]
R53  value 220  [RES0805]  (hidden comment: ChipRes)
R54  value 220  [RES0805]  (hidden comment: ChipRes)
R55  value 220  [RES0805]  (hidden comment: ChipRes)
R56  value 220  [RES0805]  (hidden comment: ChipRes)
R57  value 220  [RES0805]  (hidden comment: ChipRes)
R58  value 220  [RES0805]  (hidden comment: ChipRes)
R59  value 220  [RES0805]  (hidden comment: ChipRes)
R60  value 220  [RES0805]  (hidden comment: ChipRes)

### Ports
AGPIO (harness AnalogIO)

### Harnesses
AnalogIO: ADC[0..7], DAC[0..1], AREF, ATRIG

### Nets
GND: C22.2 C24.2 C25.2 C27.2 C28.2 C30.2 C31.2 C33.2 D5.3 D6.1 D7.1 D8.3 D9.1 D10.1 D11.3 D12.1 D13.1 D14.3 D15.1 D16.1 D17.3 D18.1 D19.1
VCC: D6.2 D7.2 D9.2 D10.2 D12.2 D13.2 D15.2 D16.2 D18.2 D19.2
ADC0: C22.1 C23.2 D5.1 D6.3 R53.2
ADC1: C25.1 C26.2 D8.1 D9.3 R55.2
ADC2: C28.1 C29.2 D11.1 D12.3 R57.2
ADC3: C31.1 C32.2 D14.1 D15.3 R59.2
ADC4: C23.1 C24.1 D5.2 D7.3 R54.2
ADC5: C26.1 C27.1 D8.2 D10.3 R56.2
ADC6: C29.1 C30.1 D11.2 D13.3 R58.2
ADC7: C32.1 C33.1 D14.2 D16.3 R60.2
DAC0: D18.3 L2.1
DAC1: D19.3 L3.1
NetD17_1: D17.1 L2.2 P10.9
NetD17_2: D17.2 L3.2 P10.10
NetP10_1: P10.1 R53.1
NetP10_2: P10.2 R54.1
NetP10_3: P10.3 R55.1
NetP10_4: P10.4 R56.1
NetP10_5: P10.5 R57.1
NetP10_6: P10.6 R58.1
NetP10_7: P10.7 R59.1
NetP10_8: P10.8 R60.1

### Buses and harness runs
bus ADC[0..7]
bus DAC[0..1]

### Library data of the parts
C22-C33 = ChipCap: Capacitor; Published: 8-Jun-2000; LatestRevisionDate: 17-Jul-2002; LatestRevisionNote: Re-released for DXP Platform.; PackageReference: RAD-0.3; Publisher: Altium Limited
D5 D8 D11 D14 D17 = TVS Diode: Dual bidirectional voltage supresor
D6 D7 D9 D10 D12 D13 D15 D16 D18 D19 = Schottky Diode: 2-Diode Schottky
L2 L3 = ChipInductance
P10 = Socket_10x5.08_RA_2Wall: Terminal Block Socket Right Angle 10x5.08mm 2-Wall
R53-R60 = ChipRes: Chip resistor

## Sheet IsolatedPortOut.SchDoc
size A4
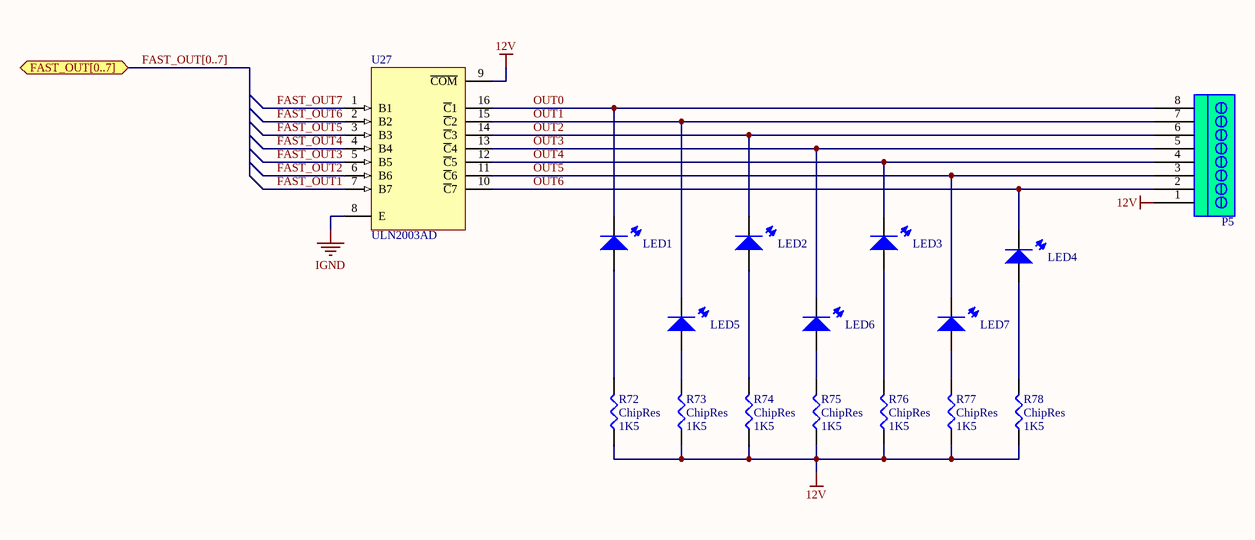
[diagram p5: IsolatedPortOut.SchDoc]

### Parts
LED1  LED 0603  [LED 0603]  (value not drawn)
LED2  LED 0603  [LED 0603]  (value not drawn)
LED3  LED 0603  [LED 0603]  (value not drawn)
LED4  LED 0603  [LED 0603]  (value not drawn)
LED5  LED 0603  [LED 0603]  (value not drawn)
LED6  LED 0603  [LED 0603]  (value not drawn)
LED7  LED 0603  [LED 0603]  (value not drawn)
P5  Terminal Block 8x5.08mm  [SOCKET 8x5.08]  (value not drawn)
R72  ChipRes  value 1K5  [RES0805]
R73  ChipRes  value 1K5  [RES0805]
R74  ChipRes  value 1K5  [RES0805]
R75  ChipRes  value 1K5  [RES0805]
R76  ChipRes  value 1K5  [RES0805]
R77  ChipRes  value 1K5  [RES0805]
R78  ChipRes  value 1K5  [RES0805]
U27  ULN2003AD  [D016_N]

### Ports
FAST_OUT[0..7]

### Nets
12V: P5.1 R72.1 R73.1 R74.1 R75.1 R76.1 R77.1 R78.1 U27.9(~{COM})
IGND: U27.8(E)
FAST_OUT1: U27.7(B7)
FAST_OUT2: U27.6(B6)
FAST_OUT3: U27.5(B5)
FAST_OUT4: U27.4(B4)
FAST_OUT5: U27.3(B3)
FAST_OUT6: U27.2(B2)
FAST_OUT7: U27.1(B1)
OUT0: LED1.1 P5.8 U27.16(~{C}1)
OUT1: LED5.1 P5.7 U27.15(~{C}2)
OUT2: LED2.1 P5.6 U27.14(~{C}3)
OUT3: LED6.1 P5.5 U27.13(~{C}4)
OUT4: LED3.1 P5.4 U27.12(~{C}5)
OUT5: LED7.1 P5.3 U27.11(~{C}6)
OUT6: LED4.1 P5.2 U27.10(~{C}7)
NetLED1_2: LED1.2 R72.2
NetLED2_2: LED2.2 R74.2
NetLED3_2: LED3.2 R76.2
NetLED4_2: LED4.2 R78.2
NetLED5_2: LED5.2 R73.2
NetLED6_2: LED6.2 R75.2
NetLED7_2: LED7.2 R77.2

### Buses and harness runs
bus FAST_OUT[0..7] = port FAST_OUT[0..7]

### Library data of the parts
LED1-LED7 = LED0603
P5 = Socket_8x5.08_RA_2Wall: as P3 on sheet IsolatedGPIO
R72-R78 = ChipRes: Chip resistor
U27 = ULN2003AD: Darlington Transistor Array; Published: 15-May-2002; LatestRevisionDate: 13-Apr-2006; LatestRevisionNote: IPC-7351 Footprint Added.; DatasheetVersion: Sep-1986; PackageVersion: Jan-1998; PackageReference: D016; Publisher: Altium Limited; PackageDescription: 16-Pin Small Outline Integrated Circuit 1.27 mm Pitch; Code_IPC: SOIC127P600-16; ComponentLink1Description: Manufacturer Link; ComponentLink1URL: http://www.ti.com/; ComponentLink2Description: Datasheet; ComponentLink2URL: http://www-s.ti.com/sc/ds/uln2002a.pdf

## Sheet InPortIndication.SchDoc
size A4
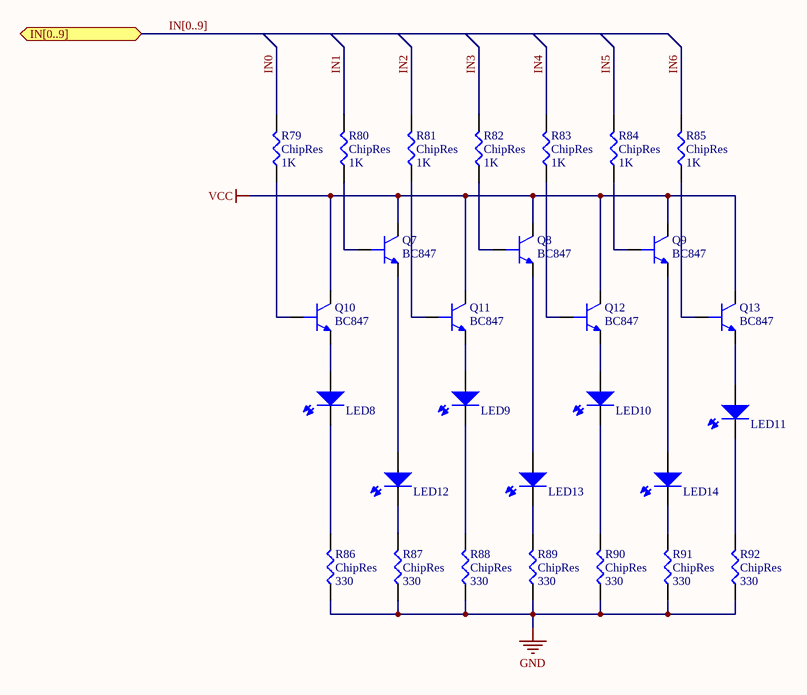
[diagram p6: InPortIndication.SchDoc]

### Parts
LED8  LED 0603  [LED 0603]  (value not drawn)
LED9  LED 0603  [LED 0603]  (value not drawn)
LED10  LED 0603  [LED 0603]  (value not drawn)
LED11  LED 0603  [LED 0603]  (value not drawn)
LED12  LED 0603  [LED 0603]  (value not drawn)
LED13  LED 0603  [LED 0603]  (value not drawn)
LED14  LED 0603  [LED 0603]  (value not drawn)
Q7  BC847  [SOT23]
Q8  BC847  [SOT23]
Q9  BC847  [SOT23]
Q10  BC847  [SOT23]
Q11  BC847  [SOT23]
Q12  BC847  [SOT23]
Q13  BC847  [SOT23]
R79  ChipRes  value 1K  [RES0805]
R80  ChipRes  value 1K  [RES0805]
R81  ChipRes  value 1K  [RES0805]
R82  ChipRes  value 1K  [RES0805]
R83  ChipRes  value 1K  [RES0805]
R84  ChipRes  value 1K  [RES0805]
R85  ChipRes  value 1K  [RES0805]
R86  ChipRes  value 330  [RES0805]
R87  ChipRes  value 330  [RES0805]
R88  ChipRes  value 330  [RES0805]
R89  ChipRes  value 330  [RES0805]
R90  ChipRes  value 330  [RES0805]
R91  ChipRes  value 330  [RES0805]
R92  ChipRes  value 330  [RES0805]

### Ports
IN[0..9]

### Nets
GND: R86.1 R87.1 R88.1 R89.1 R90.1 R91.1 R92.1
VCC: Q7.3 Q8.3 Q9.3 Q10.3 Q11.3 Q12.3 Q13.3
IN0: R79.2
IN1: R80.2
IN2: R81.2
IN3: R82.2
IN4: R83.2
IN5: R84.2
IN6: R85.2
NetLED8_1: LED8.1 R86.2
NetLED8_2: LED8.2 Q10.2
NetLED9_1: LED9.1 R88.2
NetLED9_2: LED9.2 Q11.2
NetLED10_1: LED10.1 R90.2
NetLED10_2: LED10.2 Q12.2
NetLED11_1: LED11.1 R92.2
NetLED11_2: LED11.2 Q13.2
NetLED12_1: LED12.1 R87.2
NetLED12_2: LED12.2 Q7.2
NetLED13_1: LED13.1 R89.2
NetLED13_2: LED13.2 Q8.2
NetLED14_1: LED14.1 R91.2
NetLED14_2: LED14.2 Q9.2
NetQ7_1: Q7.1 R80.1
NetQ8_1: Q8.1 R82.1
NetQ9_1: Q9.1 R84.1
NetQ10_1: Q10.1 R79.1
NetQ11_1: Q11.1 R81.1
NetQ12_1: Q12.1 R83.1
NetQ13_1: Q13.1 R85.1

### Buses and harness runs
bus IN[0..9] = port IN[0..9]

### Library data of the parts
LED8-LED14 = LED0603
Q7-Q13 = BC847: NPN transistor
R79-R92 = ChipRes: Chip resistor

## Sheet IsolatedPeltierDriver.SchDoc
size A4
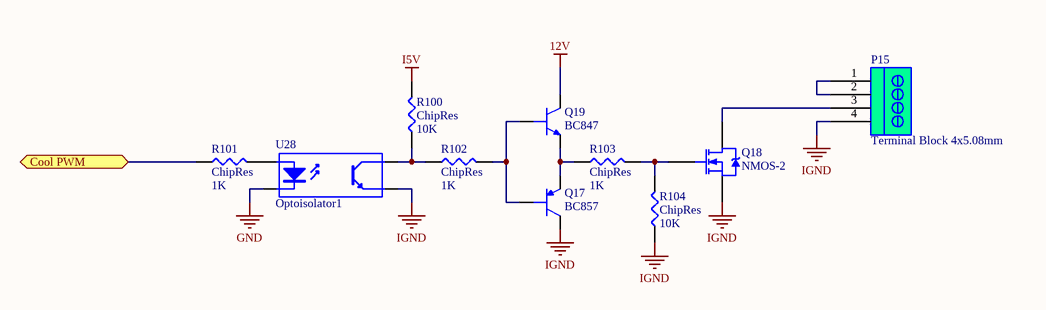
[diagram p7: IsolatedPeltierDriver.SchDoc]

### Parts
P15  Terminal Block 4x5.08mm  [Socket 4x5.08]
Q17  BC857  [SOT23]
Q18  NMOS-2  [TO-220]
Q19  BC847  [SOT23]
R100  ChipRes  value 10K  [RES0805]
R101  ChipRes  value 1K  [RES0805]
R102  ChipRes  value 1K  [RES0805]
R103  ChipRes  value 1K  [RES0805]
R104  ChipRes  value 10K  [RES0805]
U28  Optoisolator1  [DIP-4]

### Ports
Cool PWM

### Nets
12V: Q19.3
GND: U28.2(K)
I5V: R100.2
IGND: P15.4 Q17.3 Q18.3(S) R104.1 U28.3(E)
PWM0: R101.1 ; port Cool PWM
NetP15_1: P15.1 P15.2
NetP15_3: P15.3 Q18.2(D)
NetQ17_1: Q17.1 Q19.1 R102.2
NetQ17_2: Q17.2 Q19.2 R103.1
NetQ18_1: Q18.1(G) R103.2 R104.2
NetR100_1: R100.1 R102.1 U28.4(C)
NetR101_2: R101.2 U28.1(A)

### Library data of the parts
P15 = Socket_4x5.08_RA_2Wall: Terminal Block Socket Right Angle 4x5.08mm 2-Wall
Q17 = BC857: PNP Transistor
Q18 = NMOS-2: N-Channel Power MOSFET; Note: Pin 2 is electrically connected to pin 4.; Published: 8-Jun-2000; LatestRevisionDate: 17-Jul-2002; LatestRevisionNote: Re-released for DXP Platform.; DatasheetVersion: PD-9.814; PackageVersion: Feb-1997; PackageReference: TO-220AB; Publisher: Altium Limited; PackageDescription: TO, Thru-Hole, Vertical, Heatsink Mounted; 3 In-Line Leads; Pitch 2.54 mm; ComponentLink1Description: Manufacturer Link; ComponentLink1URL: http://www.irf.com/
Q19 = BC847: NPN transistor
R100-R104 = ChipRes: Chip resistor
U28 = Optoisolator1: 4-Pin Phototransistor Optocoupler; Published: 24-Mar-1999; LatestRevisionDate: 04-Mar-2005; LatestRevisionNote: Sch pins 3 & 4 Swapped.; DatasheetVersion: Nov-2003; PackageReference: DIP-4; Publisher: Altium Limited

## Nets that join several sheets
12V: Main (9 pins), IsolatedGPIO (C34.1 D21.2 U26.3), IsolatedDAC (R50.2 U20.8), IsolatedPortOut (9 pins), IsolatedPeltierDriver (Q19.3)
GND: AVRControlBoardMain (34 pins), IsolatedGPIO (22 pins), IsolatedDAC (U21.2 U21.3 U23.2 U23.3), ADC inputs (23 pins), InPortIndication (7 pins), IsolatedPeltierDriver (U28.2)
I5V: Main (R93.2 R94.2), IsolatedGPIO (24 pins), IsolatedDAC (8 pins), IsolatedPeltierDriver (R100.2)
IGND: Main (16 pins), IsolatedGPIO (22 pins), IsolatedDAC (15 pins), IsolatedPortOut (U27.8), IsolatedPeltierDriver (5 pins)
VCC: AVRControlBoardMain (24 pins), IsolatedGPIO (10 pins), ADC inputs (10 pins), InPortIndication (7 pins)
ADC0: AVRControlBoardMain (U1.6), ADC inputs (5 pins)
ADC1: AVRControlBoardMain (U1.63), ADC inputs (5 pins)
ADC2: AVRControlBoardMain (U1.64), ADC inputs (5 pins)
ADC3: AVRControlBoardMain (U1.1), ADC inputs (5 pins)
ADC4: AVRControlBoardMain (U1.2), ADC inputs (5 pins)
ADC5: AVRControlBoardMain (U1.3), ADC inputs (5 pins)
ADC6: AVRControlBoardMain (U1.4), ADC inputs (5 pins)
ADC7: AVRControlBoardMain (U1.5), ADC inputs (5 pins)
DAC0: AVRControlBoardMain (U1.8), ADC inputs (D18.3 L2.1)
DAC1: AVRControlBoardMain (U1.9), ADC inputs (D19.3 L3.1)
DAC_CS: AVRControlBoardMain (U1.40), IsolatedDAC (R35.2)
DAC_MOSI: AVRControlBoardMain (U1.41), IsolatedDAC (R33.2)
DAC_SCK: AVRControlBoardMain (U1.43), IsolatedDAC (R34.2)
EXT_IN7: Main (P1.10), IsolatedGPIO (D32.1 P4.7 R16.1)
EXT_IN8: Main (P1.9), IsolatedGPIO (R107.1)
EXT_IN9: Main (P1.8 P14.2), IsolatedGPIO (R108.1)
EXT_OUT0: Main (P1.13), IsolatedGPIO (R29.2 U11.4)
EXT_OUT1: Main (P1.7 P14.1), IsolatedGPIO (R30.2 U12.4)
EXT_OUT2: Main (R42.1 R95.1), IsolatedGPIO (R31.2 U13.4)
EXT_OUT3: Main (R44.1 R96.1), IsolatedGPIO (R32.2 U14.4)
FAST_OUT0: Main (P1.6 P14.4), IsolatedGPIO (R64.2 U15.6)
FAST_OUT1: IsolatedGPIO (R65.2 U15.7), IsolatedPortOut (U27.7)
FAST_OUT2: IsolatedGPIO (R66.2 U16.6), IsolatedPortOut (U27.6)
FAST_OUT3: IsolatedGPIO (R67.2 U16.7), IsolatedPortOut (U27.5)
FAST_OUT4: IsolatedGPIO (R68.2 U17.6), IsolatedPortOut (U27.4)
FAST_OUT5: IsolatedGPIO (R69.2 U17.7), IsolatedPortOut (U27.3)
FAST_OUT6: IsolatedGPIO (R70.2 U18.6), IsolatedPortOut (U27.2)
FAST_OUT7: IsolatedGPIO (R71.2 U18.7), IsolatedPortOut (U27.1)
IN0: AVRControlBoardMain (U1.16), IsolatedGPIO (R1.2 U3.4), InPortIndication (R79.2)
IN1: AVRControlBoardMain (U1.17), IsolatedGPIO (R2.2 U4.4), InPortIndication (R80.2)
IN2: AVRControlBoardMain (U1.18), IsolatedGPIO (R3.2 U5.4), InPortIndication (R81.2)
IN3: AVRControlBoardMain (U1.19), IsolatedGPIO (R4.2 U6.4), InPortIndication (R82.2)
IN4: AVRControlBoardMain (U1.20), IsolatedGPIO (R5.2 U7.4), InPortIndication (R83.2)
IN5: AVRControlBoardMain (U1.21), IsolatedGPIO (R6.2 U8.4), InPortIndication (R84.2)
IN6: AVRControlBoardMain (U1.22), IsolatedGPIO (R7.2 U9.4), InPortIndication (R85.2)
IN7: AVRControlBoardMain (U1.23), IsolatedGPIO (R8.2 U10.4)
IN8: AVRControlBoardMain (U1.31), IsolatedGPIO (R105.2 U29.4)
IN9: AVRControlBoardMain (U1.32), IsolatedGPIO (R106.2 U30.4)
NetC36_1: Main (6 pins), IsolatedDAC (U20.1 U20.2)
OUT0: AVRControlBoardMain (U1.46), IsolatedGPIO (R21.2)
OUT1: AVRControlBoardMain (U1.47), IsolatedGPIO (R22.2)
OUT2: AVRControlBoardMain (U1.48), IsolatedGPIO (R23.2)
OUT3: AVRControlBoardMain (U1.49), IsolatedGPIO (R24.2)
OUT4: AVRControlBoardMain (U1.50), IsolatedGPIO (R25.2)
OUT5: AVRControlBoardMain (U1.51), IsolatedGPIO (R26.2)
OUT6: AVRControlBoardMain (U1.54), IsolatedGPIO (R27.2)
OUT7: AVRControlBoardMain (U1.55), IsolatedGPIO (R28.2)
OUT8: AVRControlBoardMain (U1.37), IsolatedGPIO (R17.2)
OUT9: AVRControlBoardMain (U1.36), IsolatedGPIO (R18.2)
OUT10: AVRControlBoardMain (U1.30), IsolatedGPIO (R19.2)
OUT11: AVRControlBoardMain (U1.26), IsolatedGPIO (R20.2)
PWM0: AVRControlBoardMain (U1.38), IsolatedPeltierDriver (R101.1)